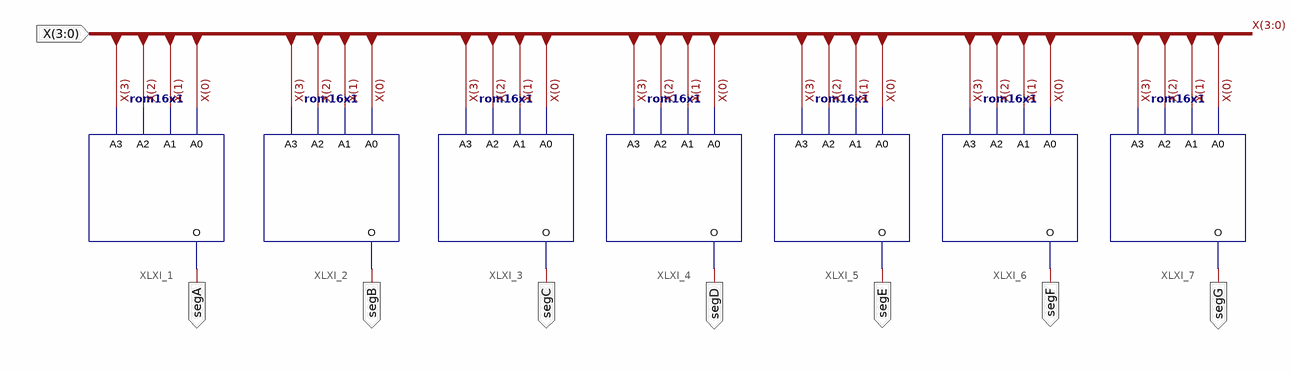
[diagram p0: schematic sheet 1]
// Xilinx ISE schematic LUT.sch (spartan3e) as structural Verilog: 7 symbols, 8 ports
module LUT (
  input  [3:0] X,
  output segB,
  output segC,
  output segD,
  output segE,
  output segF,
  output segA,
  output segG
);

  rom16x1 #(.INIT("2812")) XLXI_1 (.A0(X[0]), .A1(X[1]), .A2(X[2]), .A3(X[3]), .O(segA));
  rom16x1 #(.INIT("D860")) XLXI_2 (.A0(X[0]), .A1(X[1]), .A2(X[2]), .A3(X[3]), .O(segB));
  rom16x1 #(.INIT("D004")) XLXI_3 (.A0(X[0]), .A1(X[1]), .A2(X[2]), .A3(X[3]), .O(segC));
  rom16x1 #(.INIT("8492")) XLXI_4 (.A0(X[0]), .A1(X[1]), .A2(X[2]), .A3(X[3]), .O(segD));
  rom16x1 #(.INIT("02BA")) XLXI_5 (.A0(X[0]), .A1(X[1]), .A2(X[2]), .A3(X[3]), .O(segE));
  rom16x1 #(.INIT("208E")) XLXI_6 (.A0(X[0]), .A1(X[1]), .A2(X[2]), .A3(X[3]), .O(segF));
  rom16x1 #(.INIT("1083")) XLXI_7 (.A0(X[0]), .A1(X[1]), .A2(X[2]), .A3(X[3]), .O(segG));
endmodule
